# EAGLE design DenScript LDR V1.0 (EAGLE 9.1.0)
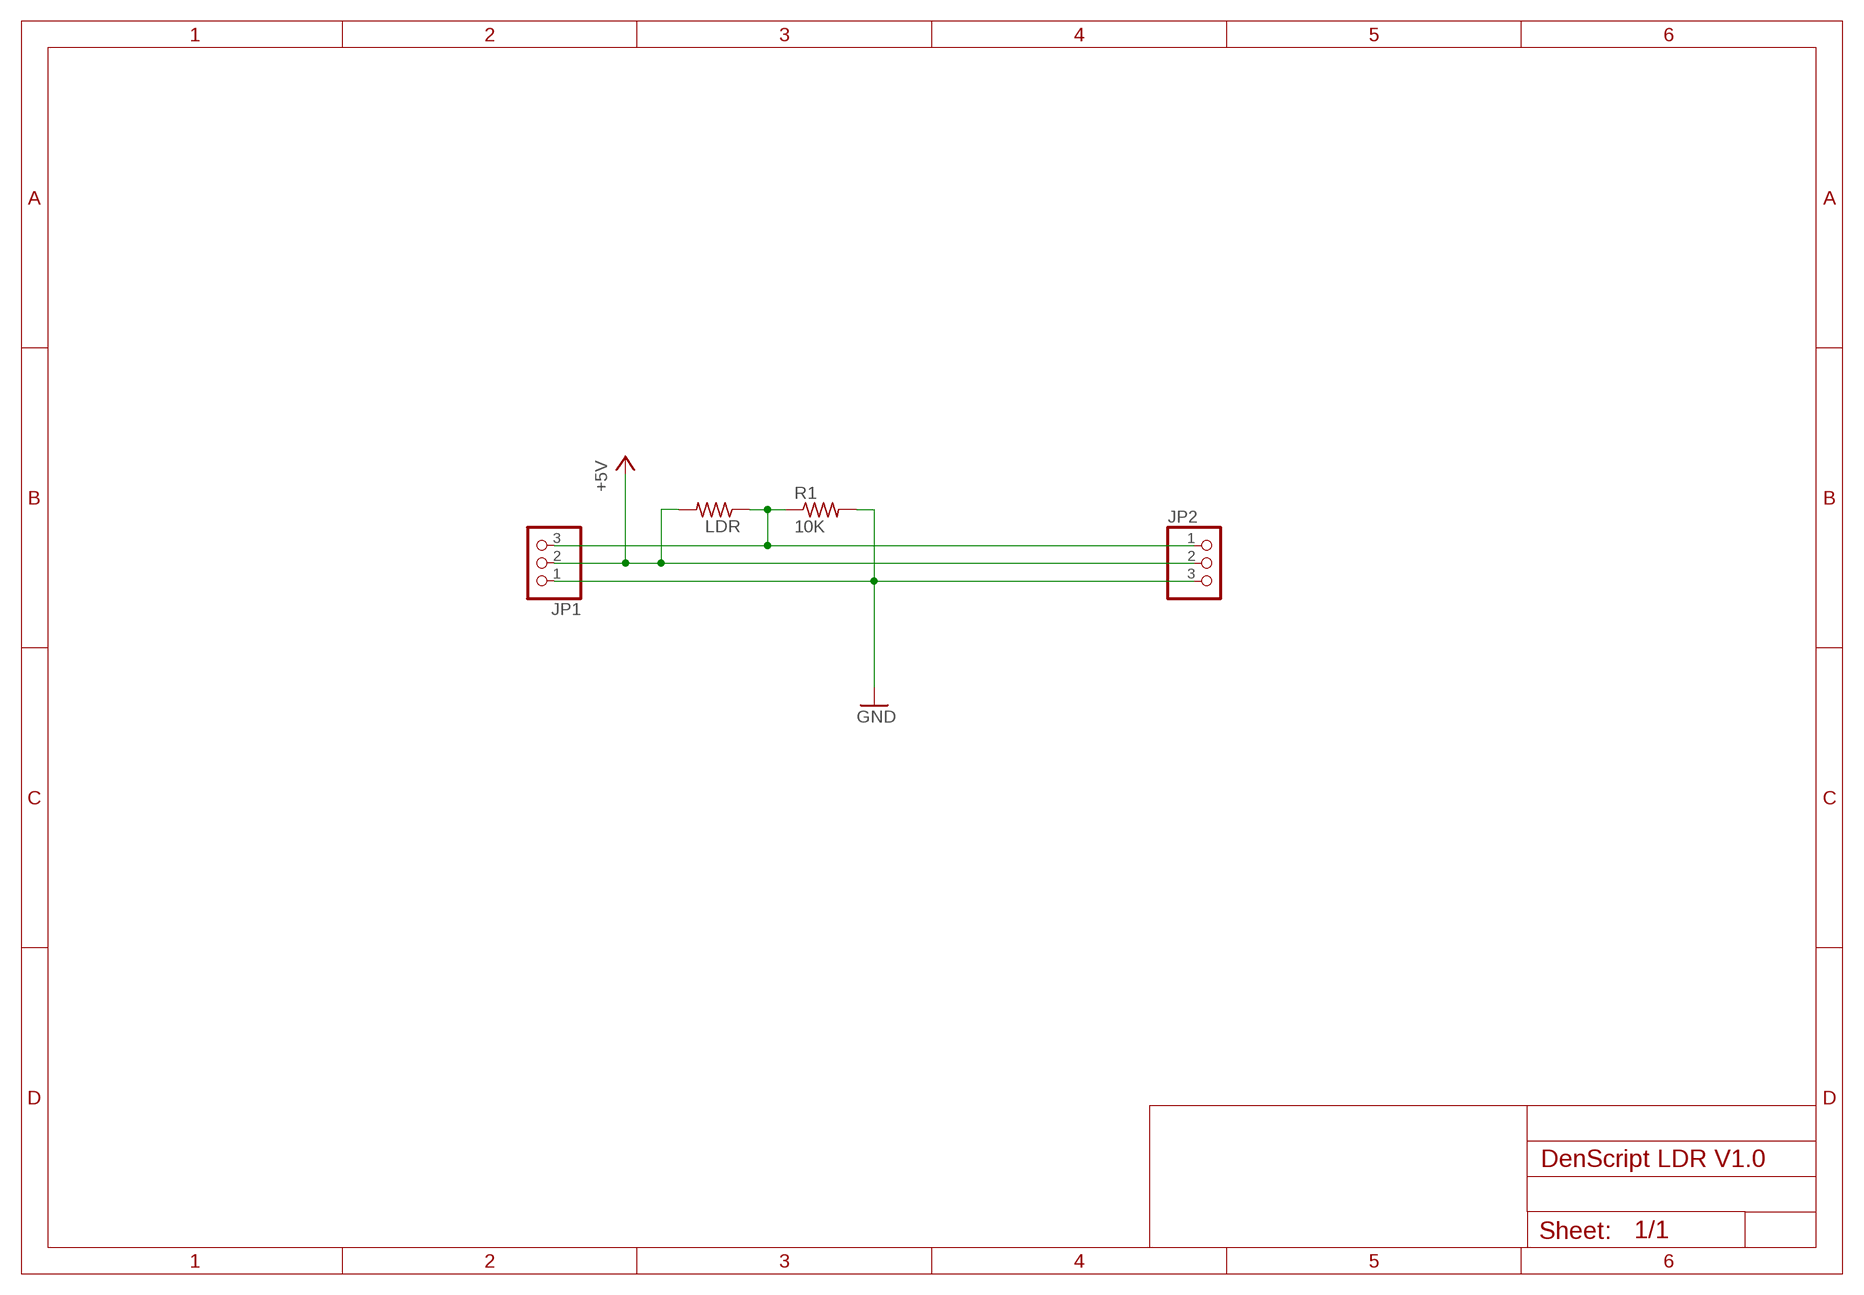
[diagram p0: schematic, sheet 1]

## Parts
JP1  PINHD-1X3  [1X03]
JP2  PINHD-1X3  [1X03]
LDR  R-US_0204/5  [0204/5]
R1  10K  R-US_R0603  [R0603]

## Nets
+5V: JP1.2 JP2.2 LDR.2
GND: JP1.1 JP2.3 R1.2
N$2: JP1.3 JP2.1 LDR.1 R1.1

## Library data of the parts
JP1 JP2 = adafruit:PINHD-1X3: PIN HEADER
LDR R1 = adafruit:R-US_: RESISTOR, American symbol

## Board
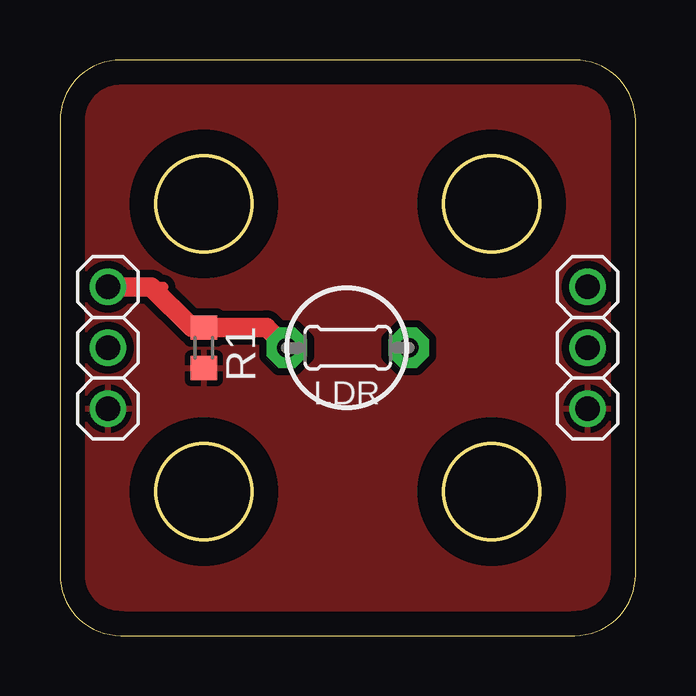
[diagram p1: board, top side]
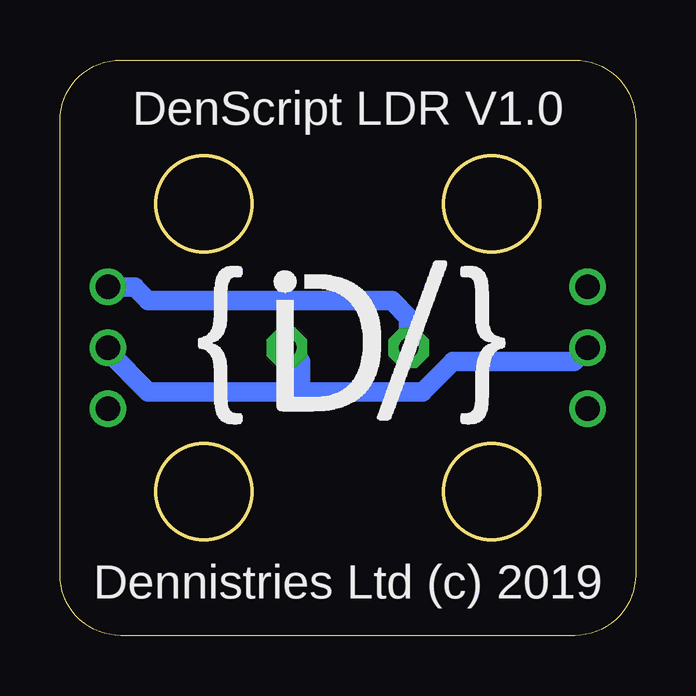
[diagram p2: board, bottom side, seen from below]

Size 24 x 24 mm. Coordinates in mm from the lower left corner, seen from the top.
Outline: 0,21.46 0,2.54 arc90 2.54,0 21.46,0 arc90 24,2.54 24,21.46 arc90 21.46,24 2.54,24 arc90 0,21.46
Outline: circle at 6,18 radius 2
Outline: circle at 6,6 radius 2
Outline: circle at 18,18 radius 2
Outline: circle at 18,6 radius 2
Copper layers (1*16): Top 0.035mm / dielectric 1.5mm / Bottom 0.035mm
Design rules "default": minimum track width 6mil, minimum drill 0.35mm, track to track 6mil, track to pad 6mil, pad to pad 6mil, via to via 6mil, smd to smd 6mil, copper to edge 40mil, drill to drill 6mil, minimum pad ring 10mil, minimum via ring 8mil, stop-mask expansion 4mil, vias tented up to drill 0mil, thermal gap 10mil

### Footprints (pad centres in the part's own frame; a part is rotated, then mirrored left to right if it is on the bottom)
1X03 = drill 1.016: 1 -2.54,0; 2 0,0; 3 2.54,0
0204/5 = drill 0.813 pad 1.676 octagon: 1 -2.54,0; 2 2.54,0
R0603 = smd 1 x 1.1: 1 -0.85,0; 2 0.85,0

### Placement (x,y rotation side)
JP1  2,12 90 top
JP2  22,12 270 top
LDR  12,12 0 top
R1  6,12 270 top

### Tracks (layer width: path | path; a pad name or v marks a point on that pad's centre or on a via)
+5V
  Bottom 0.813: JP1.2 2.57,11.43 7.62,11.43 8.89,10.16 13.97,10.16 | 13.97,10.16 20.32,10.16 22,11.84 JP2.2 | LDR.2 13.97,11.43 13.97,10.16
GND
  pour Top (isolate 0.305): 0,0 24.13,0 24.13,24.13 0,24.13
N$2
  Top 0.406: 4.31,14.54 3.81,14.54
  Top 0.813: JP1.3 3.81,14.54 5.5,12.85 R1.1 8.61,12.85 LDR.1
  Bottom 0.406: 9.46,13.27 10.16,13.97
  Bottom 0.813: LDR.1 9.46,13.27 10.16,13.97 20.32,13.97 20.89,14.54 JP2.1

### Text on the board
bPlace: DenScript LDR V1.0 | Dennistries Ltd (c) 2019